# Altium schematic sheet CATS-Vega-Radio_MCU.SchDoc: CATS Vega
size A4; Author: Luca Jost; Revision: V1.0; SheetNumber: 12; SheetTotal: 16; Subtitle: Radio Microprocessor
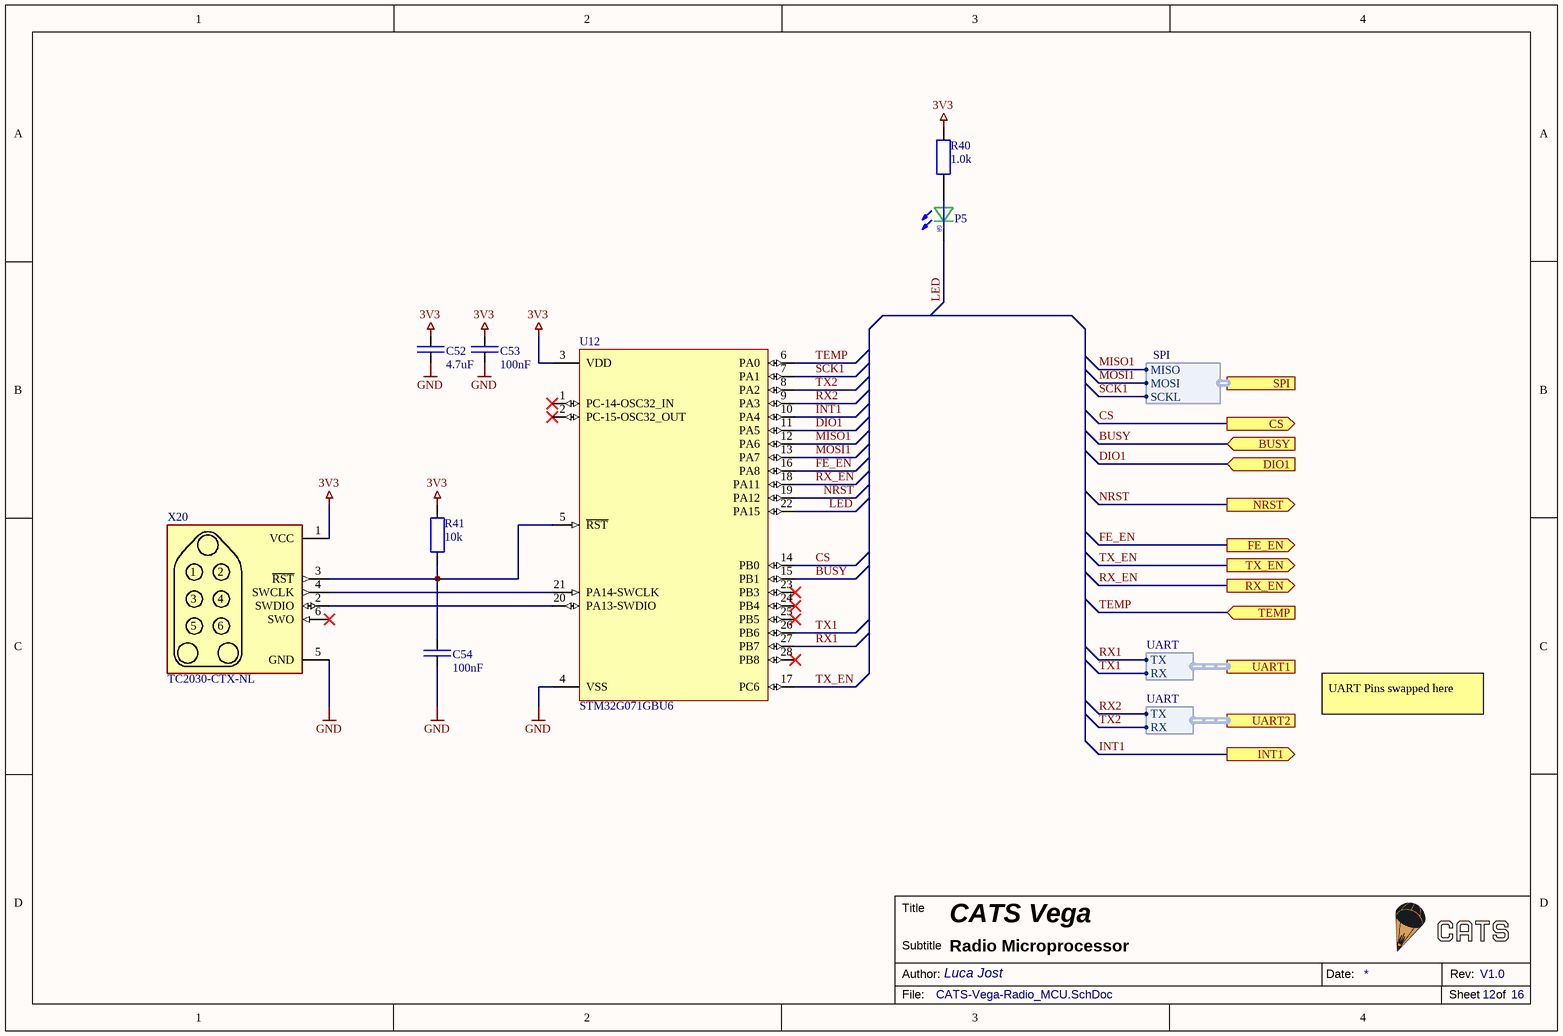
[diagram p0: CATS-Vega-Radio_MCU.SchDoc]

## Parts
C52  4.7uF  [SMD Keramikkondensator 0603]
C53  100nF  [SMD Keramikkondensator 0603]
C54  100nF  [SMD Keramikkondensator 0603]
P5  LED  [SMD LED 0603]  (value not drawn)
R40  1.0k  [SMD Widerstand 0603]
R41  10k  [SMD Widerstand 0603]
U12  STM32G071GBU6  [SMD IC QFN-28 4x4 0.5 Pitch]
X20  TC2030-CTX-NL  [SMD Connector TC2030]  (no BOM)

## Ports
BUSY (in), CS (out), DIO1 (in), FE_EN (out), INT1 (out), NRST (out), RX_EN (out), SPI (harness SPI), TEMP (in), TX_EN (out), UART1 (harness UART), UART2 (harness UART)

## Harnesses
SPI: SCKL, MOSI, MISO
UART: TX, RX

## Nets
3V3: C52.2 C53.2 R40.2 R41.2 U12.3(VDD) X20.1(VCC)
GND: C52.1 C53.1 C54.1 U12.4(VSS) X20.5(GND)
BUSY: U12.15(PB1) ; port BUSY
CS: U12.14(PB0) ; port CS
DIO1: U12.11(PA5) ; port DIO1
FE_EN: U12.16(PA8) ; port FE_EN
INT1: U12.10(PA4) ; port INT1
LED: P5.K U12.22(PA15)
MISO1: U12.12(PA6) ; port SPI.MISO
MOSI1: U12.13(PA7) ; port SPI.MOSI
NRST: U12.19(PA12) ; port NRST
RX1: U12.27(PB7) ; port UART1.TX
RX2: U12.9(PA3) ; port UART2.TX
RX_EN: U12.18(PA11) ; port RX_EN
SCK1: U12.7(PA1) ; port SPI.SCKL
TEMP: U12.6(PA0) ; port TEMP
TX1: U12.26(PB6) ; port UART1.RX
TX2: U12.8(PA2) ; port UART2.RX
TX_EN: U12.17(PC6) ; port TX_EN
NetC54_2: C54.2 R41.1 U12.5(~{RST}) X20.3(~{RST})
NetP5_A: P5.A R40.1
NetU12_20: U12.20(PA13-SWDIO) X20.2(SWDIO)
NetU12_21: U12.21(PA14-SWCLK) X20.4(SWCLK)

Not connected (* = marked no-connect by the designer): U12 1(PC-14-OSC32_IN)* 2(PC-15-OSC32_OUT)* 23(PB3)* 24(PB4)* 25(PB5)* 28(PB8)*; X20 6(SWO)*

## Notes on the sheet
- UART Pins swapped here
- Title
- Author:
- Subtitle
- Date:
- Rev:
- File:
- Sheet
- of
- (in symbol LED) GR

## Library data of the parts
C52 = E6 - 4.7uF: SMD Ceramic Capacitor E6; Unit Price: 0.0082; JLC: C19666
C53 C54 = E6 - 100nF: SMD Ceramic Capacitor E6; Unit Price: 0.0024; JLC: C1591
P5 = LED: Color LED; JLC: C434421; Unit Price: 0.01
R40 = E24 - 1.0k: SMD Chip Resistor E24; Unit Price: 0.001; JLC: C2907113
R41 = E24 - 10k: SMD Chip Resistor E24; Unit Price: 0.001; JLC: C99198
U12 = STM32G071GBU6: ARM® Cortex®-M0+ series Microcontroller IC 32-Bit 64MHz 128KB (128K x 8) FLASH 28-UFQFPN (4x4); Digikey: 497-18343-ND; JLC: C529347; ComponentLink1Description: Datasheet; ComponentLink1URL: https://media.digikey.com/pdf/Data%20Sheets/ST%20Microelectronics%20PDFS/STM32G071_Rev1_DS.pdf; Unit Price: 2.8446
X20 = TC2030-CTX-NL: Tag-Connect for ARM-Cortex (6-Pin)